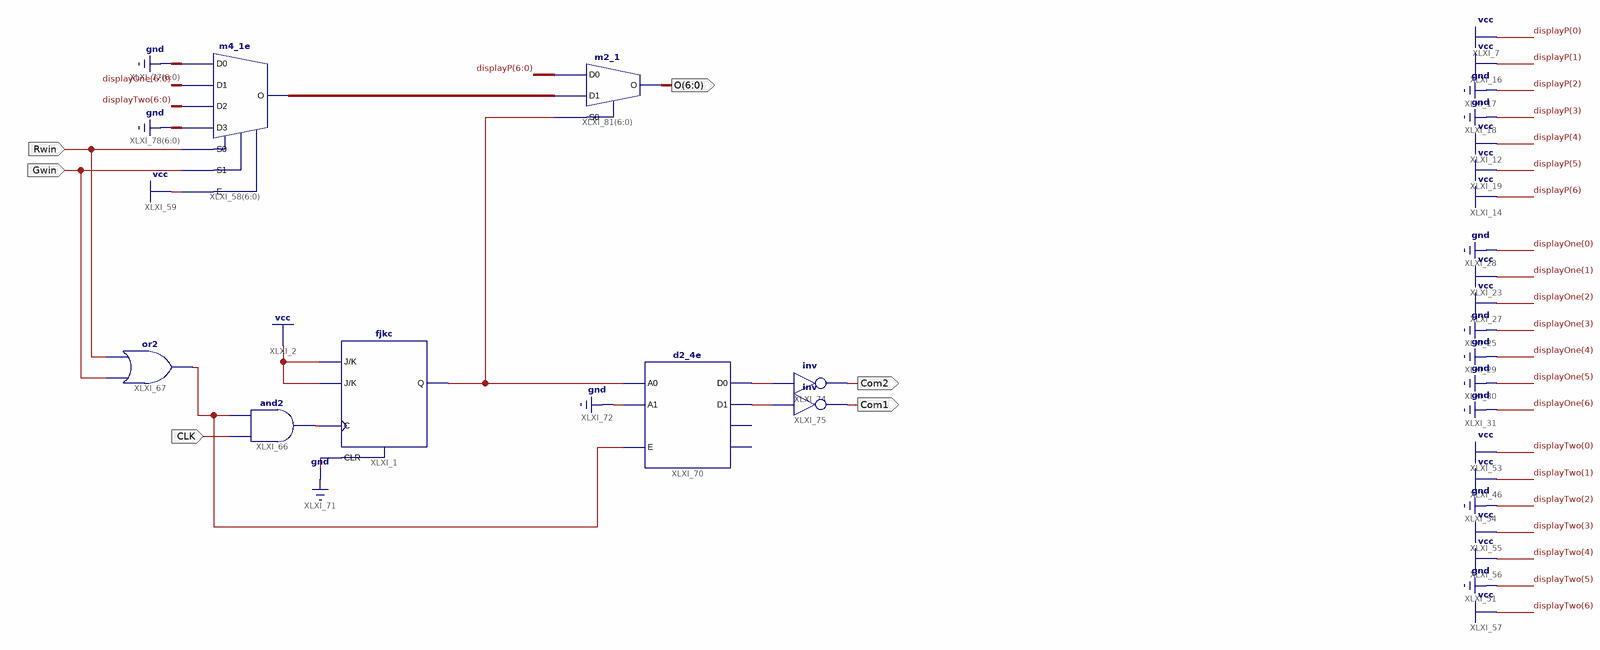
[diagram p0: schematic sheet 1]
// Xilinx ISE schematic WinText.sch (spartan6) as structural Verilog: 8 symbols, 6 ports
module WinText (
  input  Rwin,
  input  Gwin,
  input  CLK,
  output Com2,
  output Com1,
  output [6:0] O
);

  wire XLXN_78, XLXN_79, XLXN_83, XLXN_87, XLXN_88;
  wire [6:0] XLXN_80;

  m4_1e XLXI_58[6:0] (
    .D0({7{1'b0}}), .D1(7'b0000110), .D2(7'b1011011), .D3({7{1'b0}}), .E(1'b1), .S0(Rwin), .S1(Gwin),
    .O(XLXN_80));
  fjkc XLXI_1 (.C(XLXN_79), .CLR(1'b0), .J(1'b1), .K(1'b1), .Q(XLXN_83));
  and XLXI_66 (XLXN_79, CLK, XLXN_78);
  or XLXI_67 (XLXN_78, Gwin, Rwin);
  d2_4e XLXI_70 (.A0(XLXN_83), .A1(1'b0), .E(XLXN_78), .D0(XLXN_87), .D1(XLXN_88));  // open: D2, D3
  not XLXI_74 (Com2, XLXN_87);
  not XLXI_75 (Com1, XLXN_88);
  m2_1 XLXI_81[6:0] (.D0(7'b1110011), .D1(XLXN_80), .S0(XLXN_83), .O(O));
endmodule
